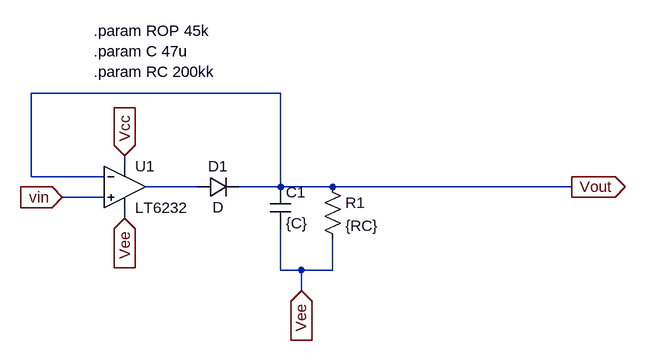
[diagram p0: schematic Hüllkurvendetektor_Ver1.asc]
Hüllkurvendetektor_Ver1.asc, the LTspice schematic file:
Version 4
SHEET 1 1584 680
WIRE 480 48 96 48
WIRE 240 160 240 144
WIRE 96 176 96 48
WIRE 208 176 96 176
WIRE 352 192 272 192
WIRE 480 192 480 48
WIRE 480 192 416 192
WIRE 560 192 480 192
WIRE 928 192 560 192
WIRE 208 208 144 208
WIRE 240 240 240 224
WIRE 480 320 480 256
WIRE 512 320 480 320
WIRE 560 320 560 272
WIRE 560 320 512 320
WIRE 512 352 512 320
FLAG 240 144 Vcc
IOPIN 240 144 In
FLAG 240 240 Vee
IOPIN 240 240 In
FLAG 928 192 Vout
IOPIN 928 192 Out
FLAG 512 352 Vee
IOPIN 512 352 In
FLAG 144 208 vin
IOPIN 144 208 In
SYMBOL Opamps\\LT6232 240 192 R0
SYMATTR InstName U1
SYMBOL cap 464 192 R0
SYMATTR InstName C1
SYMATTR Value {C}
SYMBOL res 544 176 R0
SYMATTR InstName R1
SYMATTR Value {RC}
SYMBOL diode 352 208 R270
WINDOW 0 32 32 VTop 2
WINDOW 3 0 32 VBottom 2
SYMATTR InstName D1
TEXT 192 -48 Left 2 !.param ROP 45k\n.param C 47u\n.param RC 200kk

The netlist it stands for:
* Hüllkurvendetektor_Ver1.asc
* U1: LT6232 (symbol Opamps\LT6232 not available, pins judged from their places): In+=vin In-=Vout V+=Vcc V-=Vee OUT=N001
C1 Vout Vee {C}
R1 Vout Vee {RC}
D1 N001 Vout D
.model D D
.lib standard.dio
.param ROP 45k
.param C 47u
.param RC 200kk
.backanno
.end